# Altium schematic sheet mpuhand2.SchDoc
size A4; SheetNumber: 2; SheetTotal: 2
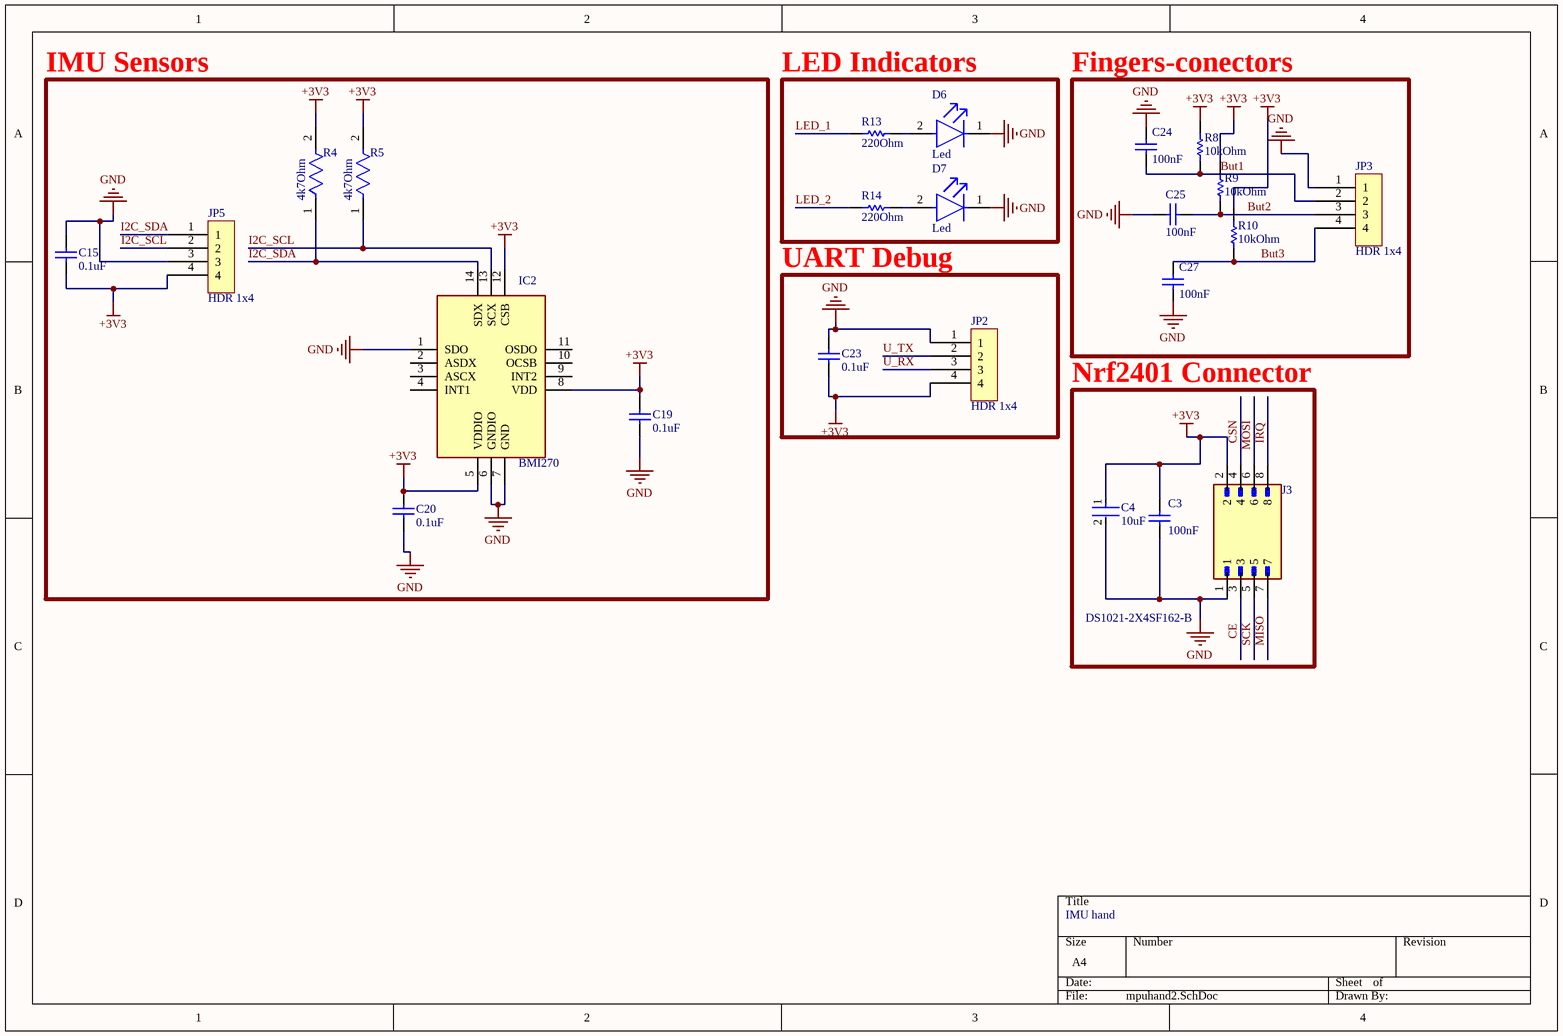
[diagram p0: mpuhand2.SchDoc]

## Parts
C3  100nF  [CAPC1050X55X23ML05T13]
C4  10uF  [FP-CL21-IPC_B]
C15  0.1uF  [CAPC1050X55X23ML05T13]
C19  0.1uF  [CAPC1050X55X23ML05T13]
C20  0.1uF  [CAPC1050X55X23ML05T13]
C23  0.1uF  [CAPC1050X55X23ML05T13]
C24  100nF  [CAPC1050X55X23ML05T13]
C25  100nF  [CAPC1050X55X23ML05T13]
C27  100nF  [CAPC1050X55X23ML05T13]
D6  Led  [FP-LTST-C191GKT-MFG]
D7  Led  [FP-LTST-C191GKT-MFG]
IC2  BMI270  [BMI270]
J3  DS1021-2X4SF162-B  [CONNFLY_DS1021-2X4SF162-B]
JP2  HDR 1x4  [HDR Male1_4 2.54mm]
JP3  HDR 1x4  [HDR Male1_4 2.54mm]
JP5  HDR 1x4  [HDR Male1_4 2.54mm]
R4  4k7Ohm  [FP-RC0402-0_4-MFG]
R5  4k7Ohm  [FP-RC0402-0_4-MFG]
R8  10kOhm  [RESC2013X60X35ML10T20]
R9  10kOhm  [RESC2013X60X35ML10T20]
R10  10kOhm  [RESC2013X60X35ML10T20]
R13  220Ohm  [RESC1608X55X25ML10T15]
R14  220Ohm  [RESC1608X55X25ML10T15]

## Blocks framed on the sheet
IMU Sensors: C15 C19 C20 IC2 JP5 R4 R5
LED Indicators: D6 D7 R13 R14
Fingers-conectors: C24 C25 C27 JP3 R8-R10
UART Debug: C23 JP2
Nrf2401 Connector: C3 C4 J3

## Nets
+3V3: C3.2 C4.1 C15.1 C19.2 C20.2 C23.1 IC2.5(VDDIO) IC2.8(VDD) IC2.12(CSB) J3.2 JP2.4 JP5.4 R4.2 R5.2 R8.2 R9.2 R10.2
GND: C3.1 C4.2 C15.2 C19.1 C20.1 C23.2 C24.2 C25.1 C27.1 D6.1(C) D7.1(C) IC2.1(SDO) IC2.6(GNDIO) IC2.7(GND) J3.1 JP2.1 JP3.1 JP5.3
But1: C24.1 JP3.2 R8.1
But2: C25.2 JP3.3 R9.1
But3: C27.2 JP3.4 R10.1
CE: J3.3
CSN: J3.4
I2C_SCL: IC2.13(SCX) JP5.2 R5.1
I2C_SDA: IC2.14(SDX) JP5.1 R4.1
IRQ: J3.8
LED_1: R13.2
LED_2: R14.2
MISO: J3.7
MOSI: J3.6
SCK: J3.5
U_RX: JP2.3
U_TX: JP2.2
NetD6_2: D6.2(A) R13.1
NetD7_2: D7.2(A) R14.1

Not connected (* = marked no-connect by the designer): IC2 2(ASDX) 3(ASCX) 4(INT1) 9(INT2) 10(OCSB) 11(OSDO)

## Notes on the sheet
- IMU hand

## Library data of the parts
C3 C15 C19 C20 C23-C25 C27 = CMP-2000-05439-1: Chip Capacitor, 100 nF, +/- 10%, 16 V, -55 to 125 degC, 0402 (1005 Metric), RoHS, Tape and Reel; Manufacturer: Samsung Electro-Mechanics; Capacitance: 100000pF; Dielectric: X7R; Rated Voltage: 16V; Case Size/Dimension: 0402; Tolerance (%): ±10%; Manufacturer URL: http://www.samsungsem.com/global/index.jsp; Datasheet URL: https://datasheet.ciiva.com/29198/458718-da-01-en-vs-kondensator-0402-29198423.pdf; Datasheet Version: Nov-10
C4 = CMP-2000-06102-2: CL21 Series 0805 10uF 16V ±10% Tolerance X5R Multilayer Ceramic Chip Capacitor; Dielectric: X7R; Length: 2mm; Depth: 1.25mm; Voltage: 16V; Width: 0.049inch; Capacitance: 10uF; Lead Free: Lead Free; Max Operating Temperature: 85°C; Mount: Surface Mount; Voltage Rating: 16V; Height: 1.25mm; Radiation Hardening: No; Packaging: Tape and Reel; Voltage Rating (DC): 16V; Thickness: 0.055inch; Case/Package: 0805; Case Code (Imperial): 0805; Min Operating Temperature: -55°C; Case Code (Metric): 2012; Package Quantity: 1; Tolerance: 10%
D6 D7 = CMP-22017-000029-1: LED GREEN CLEAR CHIP SMD; Power Dissipation: 100mW; Lens Color: Colorless; Number of Elements: 1; Dominant Wavelength: 569nm; Forward Voltage: 2.1V; Forward Current: 30mA; Test Current: 20mA; Viewing Angle: 130°; Wavelength: 565nm; Luminous Intensity: 12mcd; Reverse Voltage: 5V; Case/Package: 0603; Package Quantity: 1; Illumination Color: Green; Lens Style: Clear; Lens Transparency: Clear; Depth: 0.8mm; Power Rating: 100mW; Width: 0.8mm; Height: 0.55mm; Radiation Hardening: No; Case Code (Imperial): 0603; Number of Pins: 2; Length: 1.6mm; Case Code (Metric): 1608; Max Operating Temperature: 85°C; Color: Green; Packaging: Tape and Reel; Mount: Surface Mount; Min Operating Temperature: -55°C; Lead Free: Lead Free; Number of LEDs: 1
IC2 = BMI270: Integrated Circuit; Manufacturer_Name: BOSCH; Datasheet Link: https://www.bosch-sensortec.com/media/boschsensortec/downloads/datasheets/bst-bmi270-ds000.pdf; Height: 0.87mm; Manufacturer_Part_Number: BMI270; Mouser Part Number: 262-BMI270; Mouser Price/Stock: https://www.mouser.co.uk/ProductDetail/Bosch-Sensortec/BMI270?qs=u16ybLDytRYIj%252BjQEee88A%3D%3D; Arrow Part Number: BMI270; Arrow Price/Stock: https://www.arrow.com/en/products/bmi270/bosch-sensortec?utm_currency=USD&region=europe
J3 = DS1021-2X4SF162-B: Pin header; pin strips; male; PIN: 8; straight; 2.54mm; THT; 2x4; MF: Connfly; SnapEDA_Link: https://www.snapeda.com/parts/DS1021-2X4SF162-B/Connfly/view-part/?ref=snap; Package: None; Value: *; MP: DS1021-2X4SF162-B; Check_prices: https://www.snapeda.com/parts/DS1021-2X4SF162-B/Connfly/view-part/?ref=eda
JP2 JP3 JP5 = 68001-204HLF: CONN HEADER VERT 4POS 2.54MM; Manufacturer: Amphenol FCI; Current Rating: 3A; Voltage Rating: 1.5kV; Connector Type: Male Pin; Gender: Male; Number of Positions: 4; Insulation Resistance: 5GR; Contact Post Length: 3.05mm; Manufacturer Part Number: 68001-204HLF; RoHS: Yes; Category: Headers and Wire Housings; Stock 1: 2857; Pricing 1: 1=0,38000, 10=0,35700, 100=0,25010, 500=0,21442, 1000=0,17868, 5000=0,15315, 10000=0,14294 (USD); Mount: Through Hole; Color: Black; Contact Plating: Gold,GXT; Contact Material: Bronze; Housing Material: Thermoplastic; Min Operating Temperature: -65°C; Max Operating Temperature: 125°C; Package Quantity: 100; Number of Rows: 1; Packaging: Bulk; Contact Gender: Male; Termination: Solder; Number of Contacts: 4; Orientation: Straight; Pitch: 2.54mm; Contact Mating Length: 0.23inch; Radiation Hardening: No; Flammability Rating: UL94 V-0; ComponentLink1URL: https://datasheet.ciiva.com/5164/68000-274255-5164127.pdf?src-supplier=Mouser; ComponentLink1Description: https://datasheet.ciiva.com/5164/68000-274255-5164127.pdf?src-supplier=Mouser; ComponentLink2URL: https://datasheet.ciiva.com/726/68000-726529.pdf?src-supplier=Digi-Key; ComponentLink2Description: https://datasheet.ciiva.com/726/68000-726529.pdf?src-supplier=Digi-Key; Supplier 1: Digi-Key; Supplier Part Number 1: 609-3402-ND
R4 R5 = CMP-2002-08011-2: Tolerance: 5%; Power Rating: 63mW; Resistance: 4.7kΩ; Voltage Rating: 50V; Temperature Coefficient: 100ppm/°C; Composition: Thick Film; Max Operating Temperature: 155°C; Case/Package: 0402; Depth: 500µm; Packaging: Tape & Reel; Number of Pins: 2; Schedule B: 8533210045, 8533210045; Case Code (Imperial): 0402; Termination: SMD/SMT; Military Standard: Not; Lead Free: Lead Free; Width: 500µm; REACH SVHC: No SVHC; Max Power Dissipation: 63mW; Voltage Rating (AC): 50V; Features: Moisture Resistant; Min Operating Temperature: -55°C; Number of Terminations: 2; RoHS: Compliant; Height: 350µm; Voltage Rating (DC): 50V; Length: 1mm
R8-R10 = CMP-2000-05025-1: Chip Resistor, 10 KOhm, +/- 5%, 0.125 W, -55 to 155 degC, 0805 (2012 Metric), RoHS, Tape and Reel; Manufacturer: Yageo; Resistor Element Type: ThickFilm; Voltage Rating: 150V; Product Range: RCSeries; SVHC: ToBeAdvised; Resistor Case Style: 0805[2012Metric]; Temperature Coefficient: ±100ppm/degC; Power Rating: 250mW; Automotive Qualification Standard: -; Datasheet Version: REV. 2, 09/2004; Packaging: CutTape; Resistance Tolerance: ±5%; MSL: MSL1-Unlimited; Manufacturer URL: http://www.yageo.com/; Resistance: 10kohm; Datasheet URL: http://www.yageo.ru/pdf/RC0805.pdf; Package Description: 2-Pin Surface Mounted Device, Body 2 x 1.25 mm; Package Reference: 805
R13 R14 = CMP-1659-00018-2: General Purpose Chip Resistors, 220 Ohm, +/- 1%, -55 to 155 degC, 0603 (1608 Metric), RoHS, Tape and Reel; RoHSCompliant: false; DatasheetVersion: Rev. 4, 04/2009; ComponentLink2Description: Datasheet; ComponentLink2URL: https://datasheet.ciiva.com/11808/0900766b80f96399-11808136.pdf; ComponentLink1URL: http://www.yageo.com/; ComponentLink1Description: Manufacturer URL; PackageReference: 0603; PackageDescription: 2-Pin Surface Mount Device, Body 1.6 x 0.8 mm